# EAGLE design MJ828 - prod (EAGLE 9.4.0)
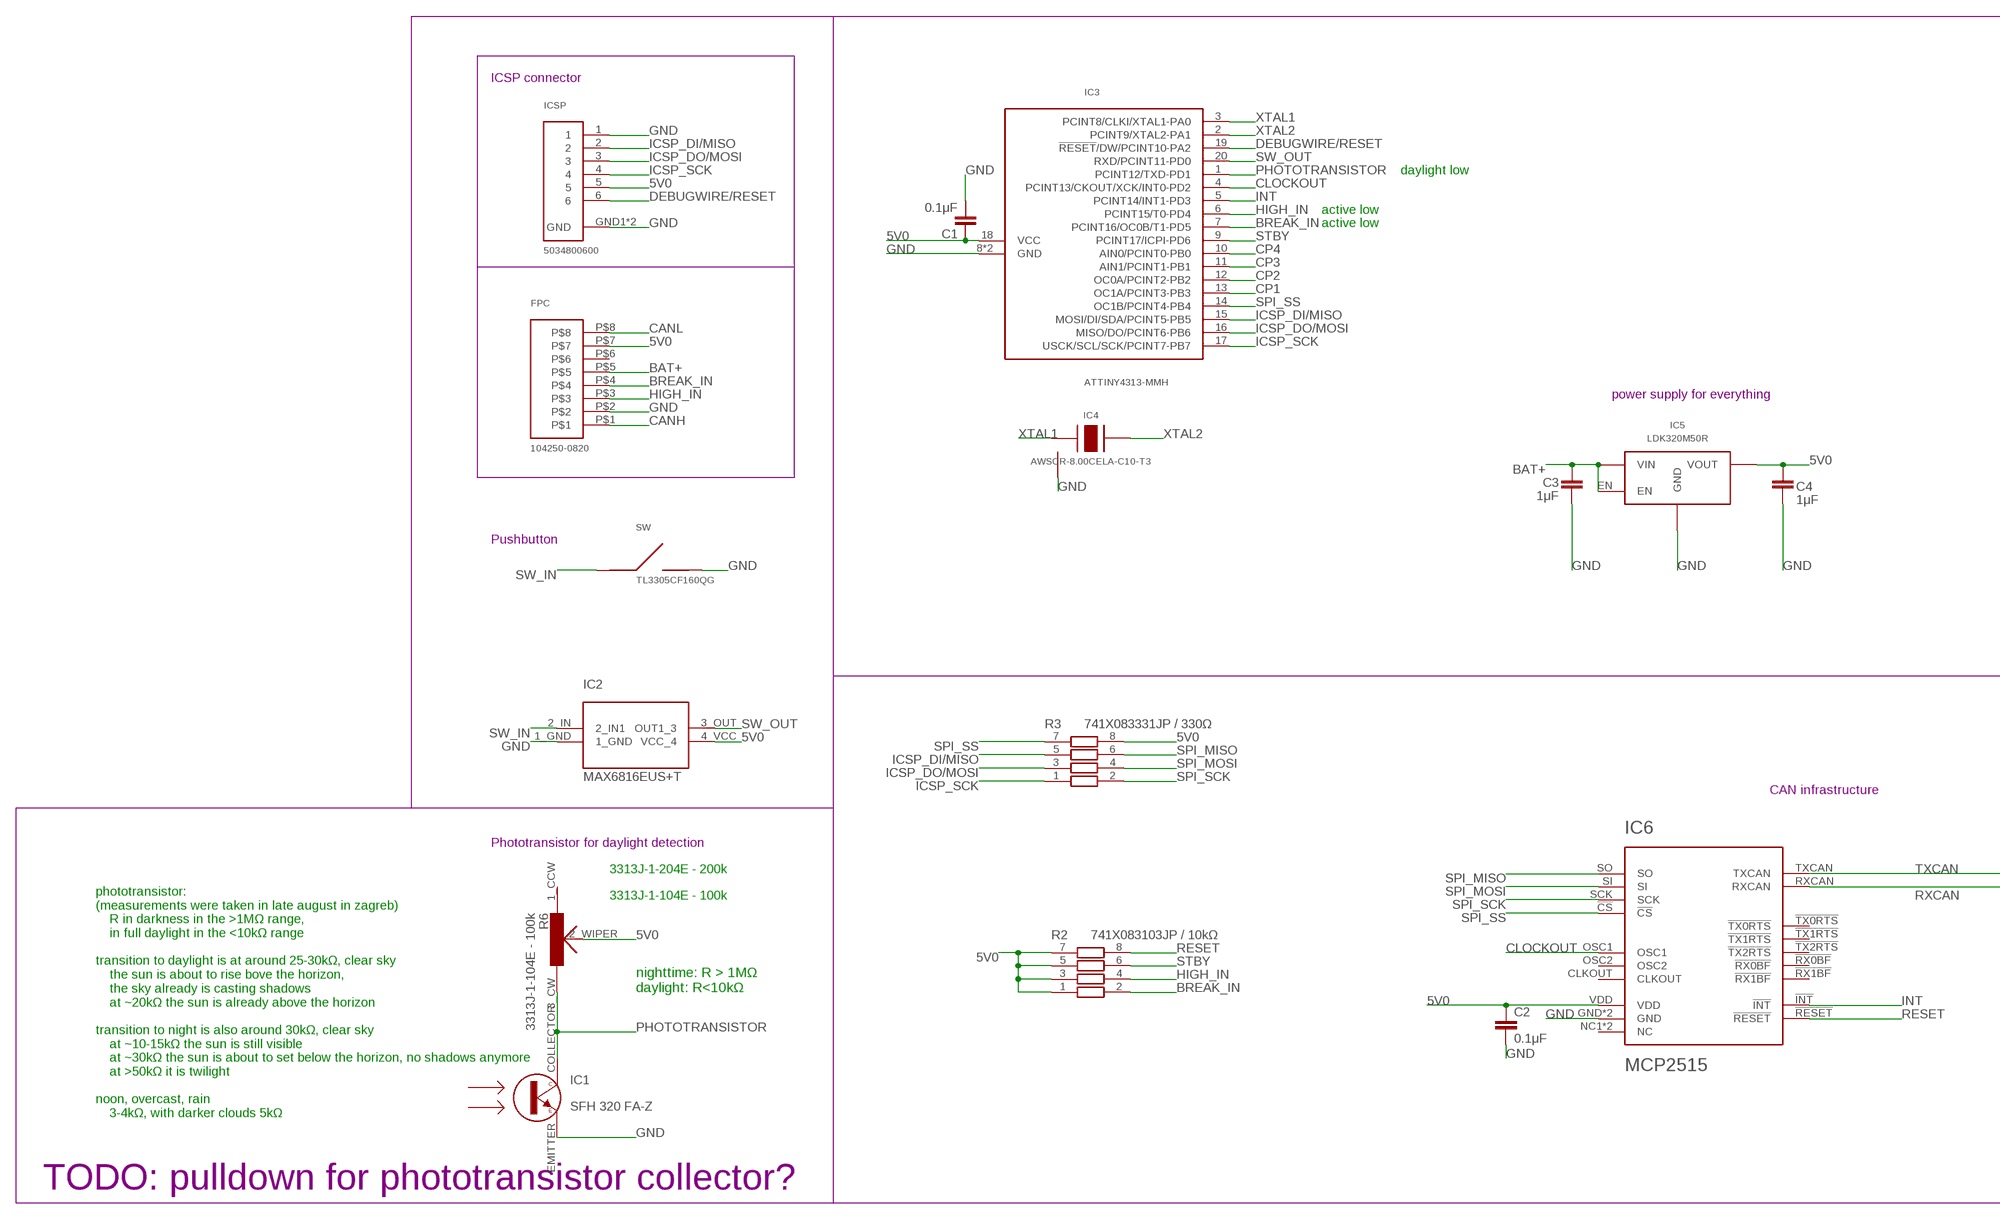
[diagram p0: schematic, sheet 1, part 1 of 2]
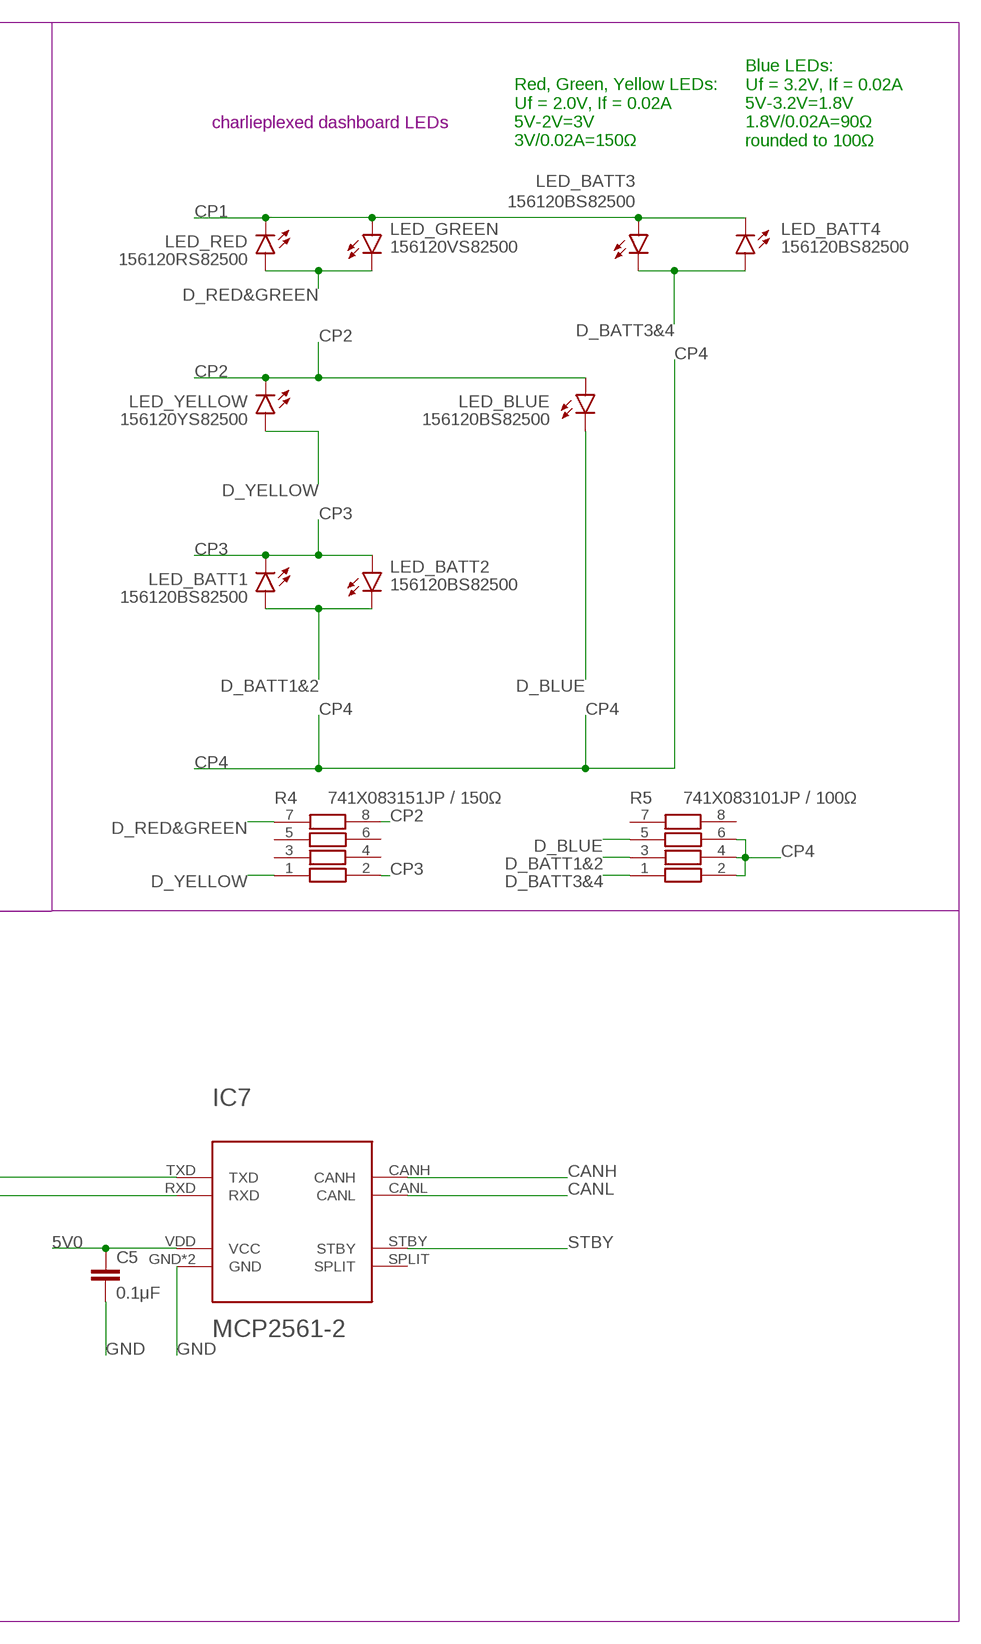
[diagram p1: schematic, sheet 1, part 2 of 2]

## Parts
C1  0.1μF  C-EUC0402  [C0402]
C2  0.1μF  C-EUC0402  [C0402]
C3  1μF  C-EUC0402  [C0402]
C4  1μF  C-EUC0402  [C0402]
C5  0.1μF  C-EUC0402  [C0402]
FPC  104250-0820  [SMD]
IC1  SFH 320 FA-Z  SFH320FA  [P-LCC-2]
IC2  MAX6816EUS+T  MAX6816  [4SOT143]
IC3  ATTINY4313-MMH  ATTINY4313VQFN-20  [VQFN-20]
IC4  AWSCR-8.00CELA-C10-T3  PRQV  [SMT]
IC5  LDK320M50R  LDK320SOT-23-5L  [SOT-23-5L]
IC6  MCP2515  MCP2515-I-ML  [QFN20]
IC7  MCP2561-2  [DFN10]
ICSP  5034800600  [SMT]
LED_BATT1  156120BS82500  LEDSML1206  [SML1206]
LED_BATT2  156120BS82500  LEDSML1206  [SML1206]
LED_BATT3  156120BS82500  LEDSML1206  [SML1206]
LED_BATT4  156120BS82500  LEDSML1206  [SML1206]
LED_BLUE  156120BS82500  LEDSML1206  [SML1206]
LED_GREEN  156120VS82500  LEDSML1206  [SML1206]
LED_RED  156120RS82500  LEDSML1206  [SML1206]
LED_YELLOW  156120YS82500  LEDSML1206  [SML1206]
R2  741X083103JP / 10kΩ  741X083331JP  [0402]
R3  741X083331JP / 330Ω  741X083331JP  [0402]
R4  741X083151JP / 150Ω  741X083331JP  [0402]
R5  741X083101JP / 100Ω  741X083331JP  [0402]
R6  3313J-1-104E - 100k  3313  [3313]
SW  TL3305CF160QG  TL3305-844809  [SMD]

## Nets
5V0 [5v0]: C1.1 C2.1 C4.2 C5.1 FPC.P$7 IC2.4_VCC(VCC_4) IC3.18(VCC) IC5.OUT(VOUT) IC6.VDD IC7.VDD(VCC) ICSP.5 R2.1 R2.3 R2.5 R2.7 R3.8 R6.2_WIPER
BAT+ [Bat+]: C3.1 FPC.P$5 IC5.EN IC5.IN(VIN)
BREAK_IN [signal]: FPC.P$4 IC3.7(PCINT16/OC0B/T1-PD5) R2.2
CANH [signal]: FPC.P$1 IC7.CANH
CANL [signal]: FPC.P$8 IC7.CANL
CLOCKOUT [signal]: IC3.4(PCINT13/CKOUT/XCK/INT0-PD2) IC6.OSC1
CP1 [signal]: IC3.13(OC1A/PCINT3-PB3) LED_BATT3.A LED_BATT4.C LED_GREEN.A LED_RED.C
CP2 [signal]: IC3.12(OC0A/PCINT2-PB2) LED_BLUE.A LED_YELLOW.C R4.8
CP3 [signal]: IC3.11(AIN1/PCINT1-PB1) LED_BATT1.C LED_BATT2.A R4.2
CP4 [signal]: IC3.10(AIN0/PCINT0-PB0) R5.2 R5.4 R5.6
D_BATT1&2 [signal]: LED_BATT1.A LED_BATT2.C R5.3
D_BATT3&4 [signal]: LED_BATT3.C LED_BATT4.A R5.1
D_BLUE [5v0]: LED_BLUE.C R5.5
D_RED&GREEN [signal]: LED_GREEN.C LED_RED.A R4.7
D_YELLOW [signal]: LED_YELLOW.A R4.1
DEBUGWIRE/RESET [signal]: IC3.19(!RESET!/DW/PCINT10-PA2) ICSP.6
GND: C1.2 C2.2 C3.2 C4.1 C5.2 FPC.P$2 IC1.EMITTER IC2.1_GND IC3.8(GND) IC3.GND IC4.GND IC5.GND IC6.GND IC6.GND6(GND) IC7.GND IC7.VSS(GND) ICSP.1 ICSP.GND1(GND) ICSP.GND2(GND) SW.3 SW.4
HIGH_IN [signal]: FPC.P$3 IC3.6(PCINT15/T0-PD4) R2.4
ICSP_DI/MISO [signal]: IC3.15(MOSI/DI/SDA/PCINT5-PB5) ICSP.2 R3.5
ICSP_DO/MOSI [signal]: IC3.16(MISO/DO/PCINT6-PB6) ICSP.3 R3.3
ICSP_SCK [signal]: IC3.17(USCK/SCL/SCK/PCINT7-PB7) ICSP.4 R3.1
INT [signal]: IC3.5(PCINT14/INT1-PD3) IC6.!INT!
PHOTOTRANSISTOR [signal]: IC1.COLLECTOR IC3.1(PCINT12/TXD-PD1) R6.3_CW
RESET [signal]: IC6.!RESET! R2.8
RXCAN [signal]: IC6.RXCAN IC7.RXD
SPI_MISO [signal]: IC6.SO R3.6
SPI_MOSI [signal]: IC6.SI R3.4
SPI_SCK [signal]: IC6.SCK R3.2
SPI_SS [signal]: IC3.14(OC1B/PCINT4-PB4) IC6.!CS! R3.7
STBY [signal]: IC3.9(PCINT17/ICPI-PD6) IC7.STBY R2.6
SW_IN [signal]: IC2.2_IN(2_IN1) SW.1 SW.2
SW_OUT [signal]: IC2.3_OUT(OUT1_3) IC3.20(RXD/PCINT11-PD0)
TXCAN [signal]: IC6.TXCAN IC7.TXD
XTAL1 [signal]: IC3.3(PCINT8/CLKI/XTAL1-PA0) IC4.XTAL1
XTAL2 [signal]: IC3.2(PCINT9/XTAL2-PA1) IC4.XTAL2
Unconnected: FPC.P$6 IC6.!RX0BF! IC6.!RX1BF! IC6.!TX0RTS! IC6.!TX1RTS! IC6.!TX2RTS! IC6.CLKOUT IC6.NC1(NC) IC6.NC2(NC) IC6.OSC2 IC7.SPLIT R4.3 R4.4 R4.5 R4.6 R5.7 R5.8 R6.1_CCW

## Notes on the sheet
- ICSP connector
- charlieplexed dashboard LEDs
- Red, Green, Yellow LEDs:
  Uf = 2.0V, If = 0.02A
  5V-2V=3V
  3V/0.02A=150Ω
- Blue LEDs:
  Uf = 3.2V, If = 0.02A
  5V-3.2V=1.8V
  1.8V/0.02A=90Ω
  rounded to 100Ω
- daylight low
- active low
- active low
- power supply for everything
- Pushbutton
- CAN infrastructure
- Phototransistor for daylight detection
- 3313J-1-204E - 200k
- phototransistor: 
  (measurements were taken in late august in zagreb)
      R in darkness in the >1MΩ range, 
      in full daylight in the <10kΩ range 
  
  transition to daylight is at around 25-30kΩ, clear sky
      the sun is about to rise bove the horizon,
      the sky already is casting shadows
      at ~20kΩ the sun is already above the horizon
  
  transition to night is also around 30kΩ, clear sky
      at ~10-15kΩ the sun is still visible
      at ~30kΩ the sun is about to set below the horizon, no shadows anymore
      at >50kΩ it is twilight
  
  noon, overcast, rain
      3-4kΩ, with darker clouds 5kΩ
- 3313J-1-104E - 100k
- nighttime: R > 1MΩ
  daylight: R<10kΩ
- TODO: pulldown for phototransistor collector?

## Library data of the parts
C1-C5 = rcl:C-EU: CAPACITOR, European symbol; SPICEPREFIX: C
FPC = 1042500820 - Board to Board Connector, 8p - Header:104250-0820
IC1 = SFH 320 FA - IR Phototransistor:SFH320FA
IC2 = MAX6818 CMOS Switch debouncer:MAX6816
IC3 = ATtiny4313 microcontroller:ATTINY4313; SPICEPREFIX: X
IC4 = PRQV8.00CR1510Y00L - 8MHz resonator:PRQV
IC5 = LDK320 5V LDO:LDK320
IC6 = MCP2515-I-ML - Standalonce CAN Controller with SPI Interface:MCP2515-I-ML
IC7 = MCP2561-2 - High-Speed CAN Transceiver:MCP2561-2
ICSP = 5034800600 FPC Connector:5034800600
LED_BATT1-LED_BATT4 LED_BLUE LED_GREEN LED_RED LED_YELLOW = led:LED: LED OSRAM: - CHIPLED LG R971, LG N971, LY N971, LG Q971, LY Q971, LO R971, LY R971 LH N974, LH R974 LS Q976, LO Q976, LY Q976 LO Q996 - Hyper CHIPLED LW Q18S LB Q993, LB Q99A, LB R99A - SideLED LS A670, LO A670, LY A670, LG A670, LP A670 LB A673, LV A673, LT A673, LW A673 LH A674 LY A675 LS A676, LA A676, LO A676, LY A676, LW A676 LS A679, LY A679, LG A679 - Hyper Micro SIDELED® LS Y876, LA Y876, LO Y876, LY Y876 LT Y87S - SmartLED LW L88C, LW L88S LB L89C, LB L89S, LG L890 LS L89K, LO L89K, LY L89K LS L896, LA L896, LO L896, LY L896 - TOPLED LS T670, LO T670, LY T670, LG T670, LP T670 LSG T670, LSP T670, LSY T670, LOP T670, LYG T670 LG T671, LOG T671, LSG T671 LB T673, LV T673, LT T673, LW T673 LH T674 LS T676, LA T676, LO T676, LY T676, LB T676, LH T676, LSB T676, LW T676 LB T67C, LV T67C, LT T67C, LS T67K, LO T67K, LY T67K, LW E67C LS E67B, LA E67B, LO E67B, LY E67B, LB E67C, LV E67C, LT E67C LW T67C LS T679, LY T679, LG T679 LS T770, LO T770, LY T770, LG T770, LP T770 LB T773, LV T773, LT T773, LW T773 LH T774 LS E675, LA E675, LY E675, LS T675 LS T776, LA T776, LO T776, LY T776, LB T776 LHGB T686 LT T68C, LB T68C - Hyper Mini TOPLED® LB M676 - Mini TOPLED Santana® LG M470 LS M47K, LO M47K, LY M47K Source: http://www.osram.convergy.de LUXEON: - LUMILED® LXK2-PW12-R00, LXK2-PW12-S00, LXK2-PW14-U00, LXK2-PW14-V00 LXK2-PM12-R00, LXK2-PM12-S00, LXK2-PM14-U00 LXK2-PE12-Q00, LXK2-PE12-R00, LXK2-PE12-S00, LXK2-PE14-T00, LXK2-PE14-U00 LXK2-PB12-K00, LXK2-PB12-L00, LXK2-PB12-M00, LXK2-PB14-N00, LXK2-PB14-P00, LXK2-PB14-Q00 LXK2-PR12-L00, LXK2-PR12-M00, LXK2-PR14-Q00, LXK2-PR14-R00 LXK2-PD12-Q00, LXK2-PD12-R00, LXK2-PD12-S00 LXK2-PH12-R00, LXK2-PH12-S00 LXK2-PL12-P00, LXK2-PL12-Q00, LXK2-PL12-R00 Source: www.luxeon.com KINGBRIGHT: KA-3528ASYC Source: www.kingbright.com
R2-R5 = 741X083331JP Resistor Array:741X083331JP
R6 = 3313 - Trim Poti:3313
SW = TL3305-844809 SPST-NO Tact Switch:TL3305-844809

## Net classes
0 GND: width 0.5 mm, drill 0.35 mm, clearance 0.2 mm
1 Bat+: width 0.5 mm, drill 0.35 mm, clearance 0.2 mm
2 5v0: width 0.3 mm, drill 0.35 mm, clearance 0.2 mm
3 signal: width 0.25 mm, drill 0.254 mm, clearance 0.2 mm

## Board
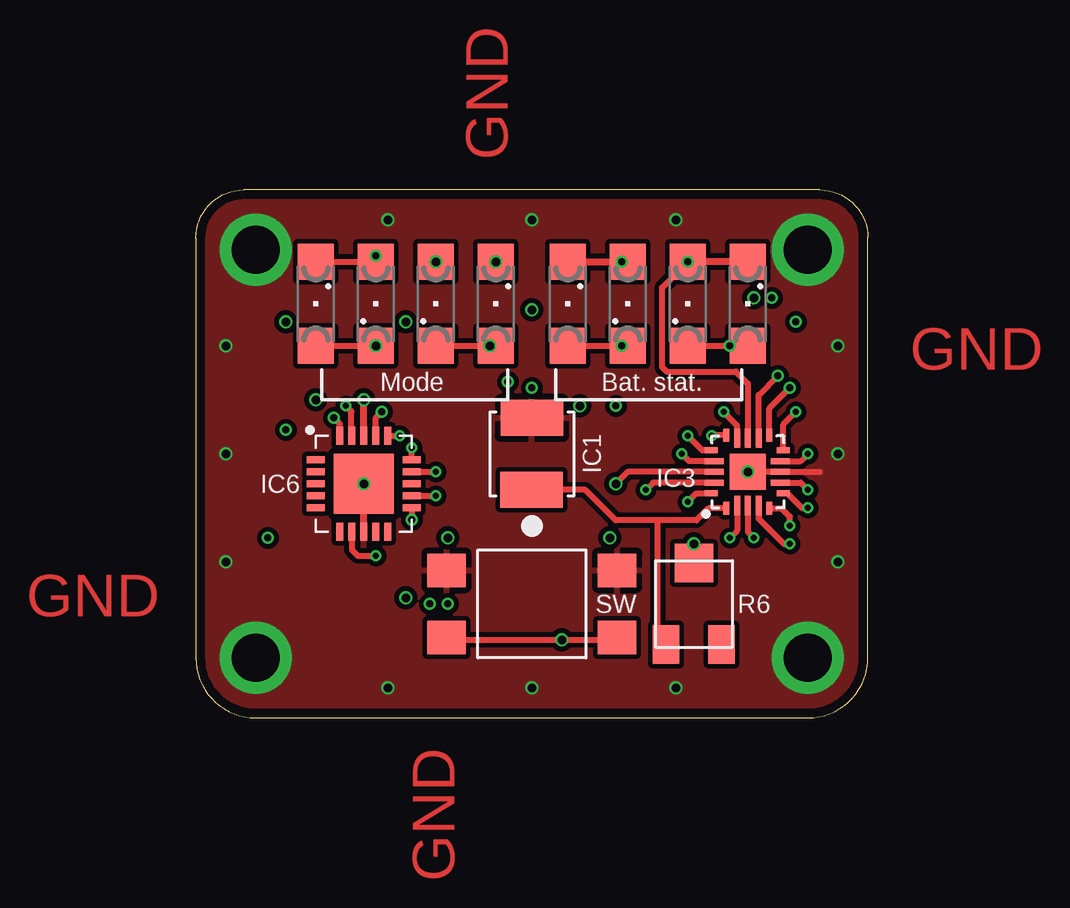
[diagram p2: board, top side]
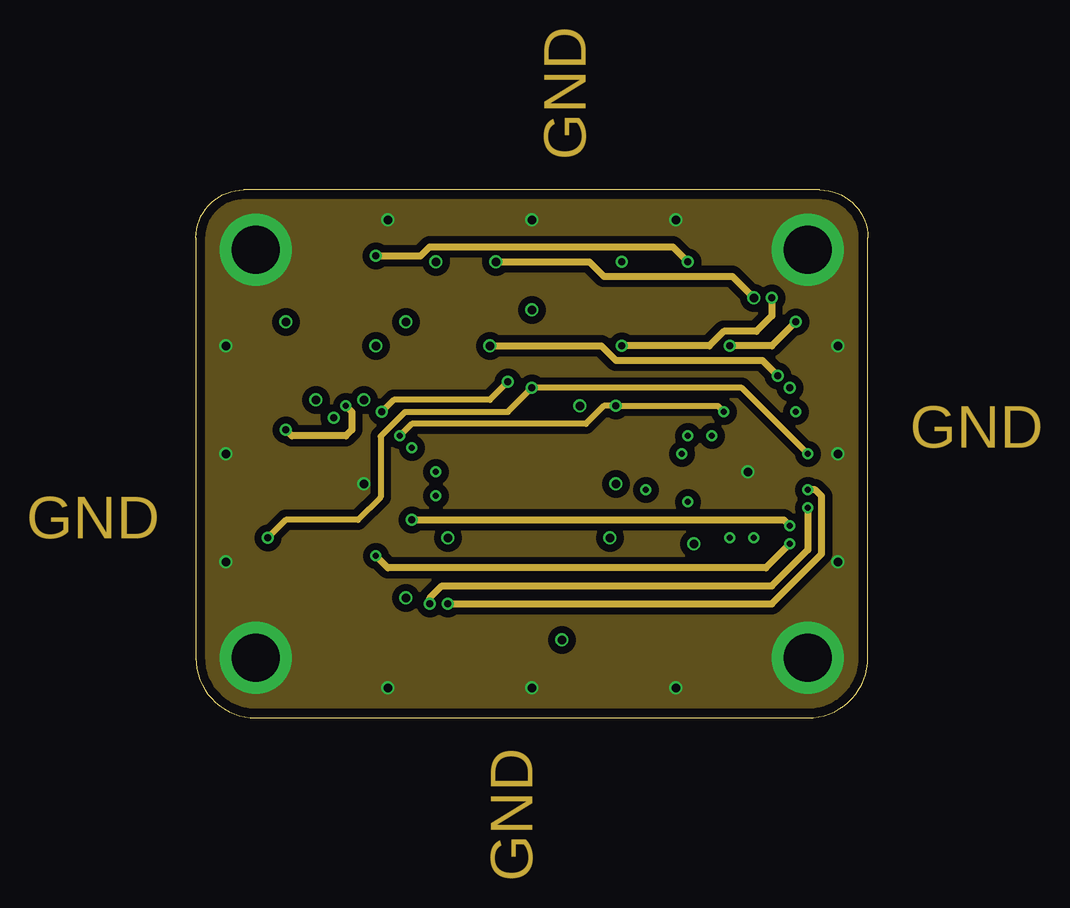
[diagram p3: board, inner layer Route2]
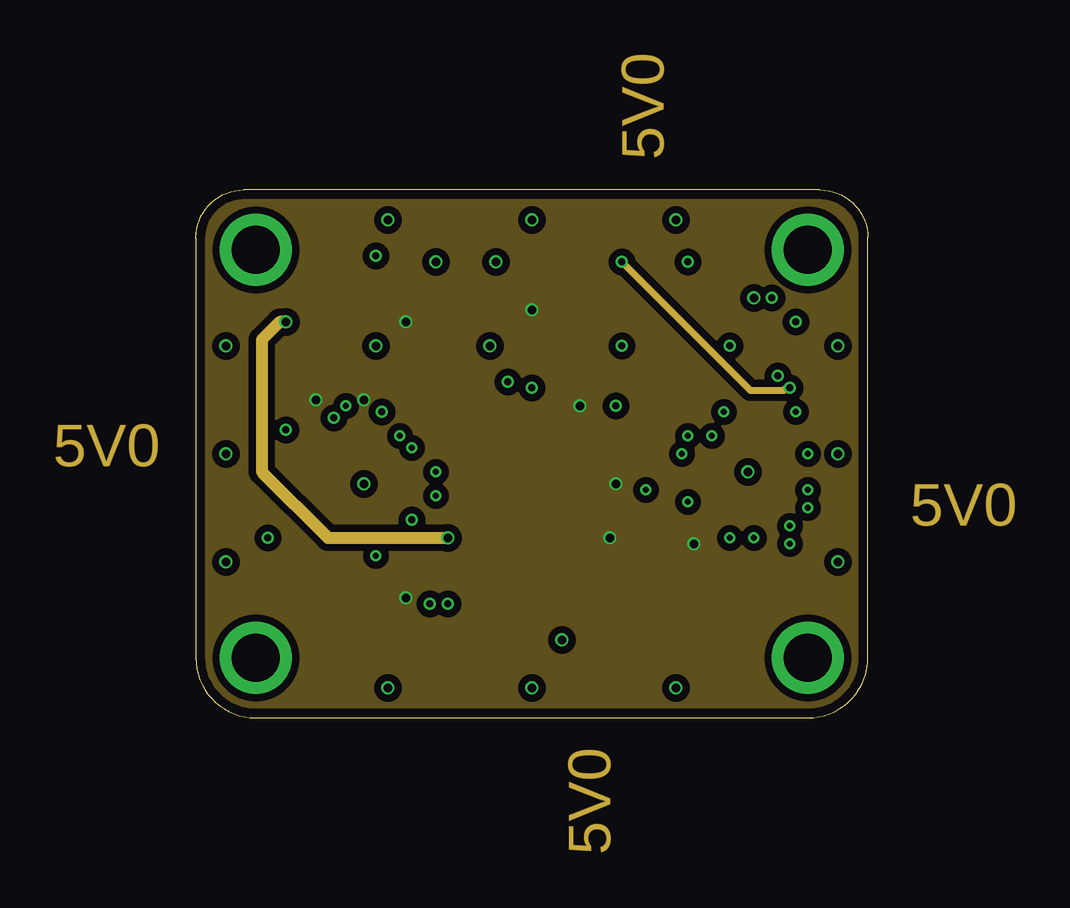
[diagram p4: board, inner layer Route15]
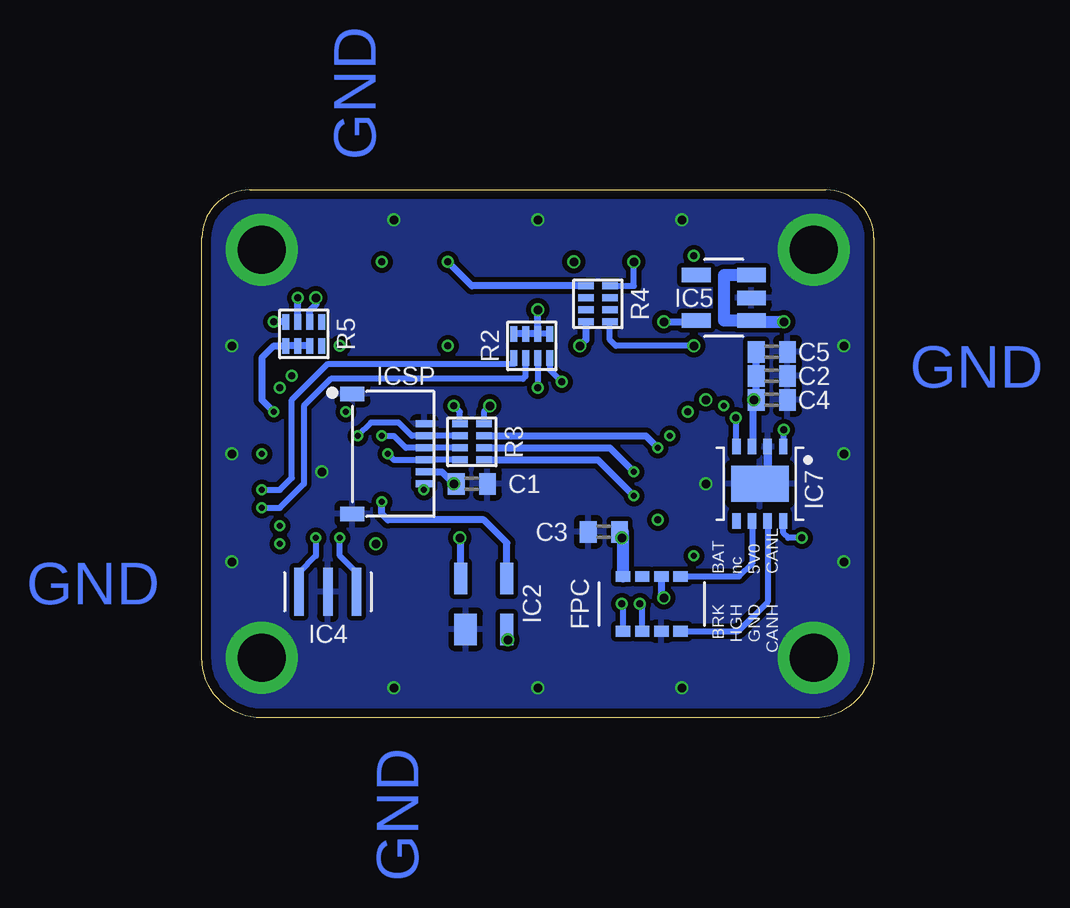
[diagram p5: board, bottom side, seen from below]

Size 28 x 22 mm. Coordinates in mm from the lower left corner, seen from the top.
Outline: 26,22 arc-90 28,20
Outline: 25.5,0 arc90 28,2.5
Outline: 0,2.5 arc90 2.5,0
Outline: 26,22 arc-90 28,20
Outline: 25.5,0 arc90 28,2.5
Outline: 0,2.5 arc90 2.5,0
Outline: 0,2.5 0,20 arc-90 2,22 26,22
Outline: 2.5,0 25.5,0
Outline: 28,2.5 28,20
Copper layers (1*2*15*16): Top 0.035559375mm / dielectric 0.17018125mm / Route2 0.01778125mm / dielectric 47mil / Route15 0.01778125mm / dielectric 0.17018125mm / Bottom 0.035559375mm
Design rules "oshpark-4layer": minimum track width 5mil, minimum drill 10mil, track to track 5mil, track to pad 5mil, pad to pad 5mil, via to via 5mil, smd to smd 5mil, copper to edge 15mil, drill to drill 6mil, minimum pad ring 4mil, minimum via ring 4mil, stop-mask expansion 2.5mil, vias tented up to drill 0mil, thermal gap 10mil
tRestrict: 6 lines

### Footprints (pad centres in the part's own frame; a part is rotated, then mirrored left to right if it is on the bottom)
C0402 = smd 0.7 x 0.9: 1 -0.65,0; 2 0.65,0
SMD = smd 0.6 x 0.45: P$1 -1.2,1.14; P$2 -0.4,1.14; P$3 0.4,1.14; P$4 1.2,1.14; P$5 1.2,-1.14; P$6 0.4,-1.14; P$7 -0.4,-1.14; P$8 -1.2,-1.14
P-LCC-2 = smd 2.6 x 1.5: COLLECTOR -0.02,-1.5; EMITTER 0,1.5
4SOT143 = smd 0.94 x 1.31: 1_GND -0.76,-1.06 | smd 0.55 x 1.31: 2_IN 0.96,-1.06; 3_OUT 0.96,1.06; 4_VCC -0.96,1.06
VQFN-20 = smd 0.55 x 0.25: 1 -1.52,0.9; 5 -1.52,-0.9; 11 1.52,-0.9; 15 1.52,0.9 | smd 0.8 x 0.25: 2 -1.4,0.45; 3 -1.4,0; 4 -1.4,-0.45; 12 1.4,-0.45; 13 1.4,0; 14 1.4,0.45 | smd 0.25 x 0.55: 6 -0.9,-1.48; 10 0.9,-1.48; 16 0.9,1.52; 20 -0.9,1.52 | smd 0.25 x 0.8: 7 -0.45,-1.35; 8 0,-1.35; 9 0.45,-1.35; 17 0.45,1.4; 18 0,1.4; 19 -0.45,1.4 | smd 1.5 x 1.5: GND 0,0
SMT = smd 0.4 x 2: GND 0,0; XTAL1 -1.2,0; XTAL2 1.2,0
SOT-23-5L = smd 0.6 x 1.2: ADJ/NC -0.95,-1.15; EN -0.95,1.15; GND 0,1.15; IN 0.95,1.15; OUT 0.95,-1.15
QFN20 = smd 0.3 x 0.75: !CS! 1,2; !RESET! 0.5,2; !RX0BF! 1,-2; !RX1BF! 0.5,-2; GND6 0,-2; OSC1 -0.5,-2; OSC2 -1,-2; RXCAN -1,2; TXCAN -0.5,2; VDD 0,2 | smd 0.75 x 0.3: !INT! 2,-1; !TX0RTS! -2,0.5; !TX1RTS! -2,0; !TX2RTS! -2,-1; CLKOUT -2,1; NC1 -2,-0.5; NC2 2,0; SCK 2,-0.5; SI 2,0.5; SO 2,1 | smd 2.5 x 2.5: GND 0,0
DFN10 = smd 0.35 x 0.65: CANH -0.325,1.55; CANL 0.325,1.55; RXD 0.975,-1.55; SPLIT 0.975,1.55; STBY -0.975,1.55; TXD -0.975,-1.55; VDD 0.325,-1.55; VSS -0.325,-1.55 | smd 2.4 x 1.5: GND 0,0
SMT' = smd 0.3 x 0.7: 1 -1.25,1.27; 2 -0.75,1.27; 3 -0.25,1.27; 4 0.25,1.27; 5 0.75,1.27; 6 1.25,1.27 | smd 0.6 x 1: GND1 -2.5,-1.73; GND2 2.5,-1.73
SML1206 = smd 1.5 x 1.5: A 1.75,0; C -1.75,0
0402 = smd 0.65 x 0.3: 1 -0.5,-0.75; 2 0.5,-0.75; 3 -0.5,-0.25; 4 0.5,-0.25; 5 -0.5,0.25; 6 0.5,0.25; 7 -0.5,0.75; 8 0.5,0.75
3313 = smd 1.1 x 1.6: 1_CCW 1.155,-1.7; 3_CW -1.155,-1.7 | smd 1.6 x 1.6: 2_WIPER 0,1.7
SMD' = smd 1.6 x 1.4: 1 -3.556,-1.397; 2 3.556,-1.397; 3 -3.556,1.397; 4 3.556,1.397

### Placement (x,y rotation side)
C1  16.75,9.75 0 bottom
C2  4.25,14.25 0 bottom
C3  11.25,7.75 180 bottom
C4  4.25,13.25 180 bottom
C5  4.25,15.25 0 bottom
FPC  9.25,4.75 180 bottom
IC1  14,11 0 top
IC2  16.25,4.75 0 bottom
IC3  23,10.25 90 top
IC4  22.75,5.25 0 bottom
IC5  6.25,17.5 270 bottom
IC6  7,9.75 0 top
IC7  4.75,9.75 180 bottom
ICSP  5034800600  [SMT']  20,11 270 bottom
LED_BATT1  15.5,17.25 270 top
LED_BATT2  18,17.25 90 top
LED_BATT3  20.5,17.25 90 top
LED_BATT4  23,17.25 270 top
LED_BLUE  12.5,17.25 270 top
LED_GREEN  7.5,17.25 90 top
LED_RED  5,17.25 270 top
LED_YELLOW  10,17.25 90 top
R2  14.25,15.5 270 bottom
R3  16.75,11.5 0 bottom
R4  11.5,17.25 180 bottom
R5  23.75,16 270 bottom
R6  20.75,4.75 0 top
SW  TL3305CF160QG  [SMD']  14,4.75 0 top

### Tracks (layer width: path | path; a pad name or v marks a point on that pad's centre or on a via)
5V0  (via drill 0.35)
  Top 0.25: IC3.18 18,10.25 v17.5,9.75
  Top 0.3: IC6.VDD v7,13.25 | R6.2_WIPER v20.75,7.25
  Bottom 0.25: v16,13 16.25,12.75 R3.8 | R2.7 R2.5
  Bottom 0.3: v17.25,7.5 17.21,7.46 IC2.4_VCC | v14,17 R2.5 R2.3 R2.1 | ICSP.5 18,10.25 v17.5,9.75 | FPC.P$7 8.85,5.1 v8.75,5 | C5.1 C2.1 C4.2 v5,13.25 5.05,13.2 5.05,11.32 IC7.VDD | v8.75,16.5 7.45,16.5 IC5.OUT
  Bottom 0.5: C1.1 v17.5,9.75
  pour Route15 (isolate 0.3): 0,22 0,0 28,0 28,22
BAT+  (via drill 0.35)
  Route15 0.5: v3.75,16.5 3.5,16.5 2.75,15.75 2.75,10.26 5.51,7.5 v10.5,7.5
  Bottom 0.5: IC5.EN 6.25,18.45 6.25,16.55 IC5.IN 5.05,16.5 v3.75,16.5 | FPC.P$5 10.45,7.45 | 10.45,7.45 10.45,7.75 C3.1 | 10.45,7.45 v10.5,7.5
BREAK_IN  (via drill 0.25, 0.3)
  Top 0.25: IC3.7 25.2,9.8 v25.5,9.5
  Route2 0.3: v10.5,4.75 24,4.75 26.08,6.83 26.08,9.24 25.82,9.5 v25.5,9.5
  Bottom 0.25: FPC.P$4 10.45,4.7 v10.5,4.75 | v25.5,9.5 24.75,9.5 24.25,10 24.25,13.25 22.75,14.75 15,14.75 R2.2
CANH
  Bottom 0.25: IC7.CANH 4.42,4.83 5.64,3.61 FPC.P$1
CANL
  Bottom 0.25: IC7.CANL 5.08,6.42 5.61,5.89 FPC.P$8
CLOCKOUT  (via drill 0.25)
  Top 0.25: v24.75,7.25 24.5,7.25 23.45,8.3 IC3.4 | IC6.OSC1 6.5,7 6.75,6.75 v7.5,6.75
  Route2 0.3: v7.5,6.75 8,6.25 23.75,6.25 v24.75,7.25
CP1  (via drill 0.3)
  Top 0.25: LED_RED.C LED_GREEN.A v7.5,19.25 | LED_BATT4.C 23.12,18.88 | LED_BATT3.A 19.43,17.93 19.43,14.62 19.61,14.43 22.5,14.43 23,13.93 IC3.13
  Top 0.3: LED_BATT4.C LED_BATT3.A
  Route2 0.3: v7.5,19.25 9.36,19.25 9.74,19.63 19.87,19.63 LED_BATT3.A
  other vias: 20.5,19
CP2  (via drill 0.3, 0.35)
  Top 0.25: LED_BLUE.A v12.25,15.5 LED_YELLOW.C | IC3.12 23.45,13.45 v24.25,14.25
  Route2 0.3: v12.25,15.5 16.9,15.5 17.5,14.9 23.6,14.9 v24.25,14.25
  Bottom 0.3: R4.8 12,15.75 v12.25,15.5
CP3  (via drill 0.3)
  Top 0.25: IC3.11 23.9,12.9 v24.75,13.75
  Top 0.3: LED_BATT1.C v17.75,19 LED_BATT2.A
  Route15 0.3: v24.75,13.75 24.6,13.75 24.5,13.65 23.1,13.65 v17.75,19
  Bottom 0.3: R4.2 16.75,18 v17.75,19
CP4  (via drill 0.25)
  Top 0.25: IC3.10 24.48,12.23 v25,12.75
  Bottom 0.3: v25,12.75 25.5,13.25 25.5,15 25,15.5 R5.2 R5.4 R5.6
D_BATT1&2  (via drill 0.3)
  Top 0.25: LED_BATT1.A v17.75,15.5
  Top 0.3: LED_BATT2.C v17.75,15.5
  Route2 0.3: v17.75,15.5 21.4,15.5 22,16.1 23.35,16.1 24,16.75 v24,17.5
  Bottom 0.3: R5.3 v24,17.5
D_BATT3&4  (via drill 0.3)
  Top 0.25: LED_BATT3.C LED_BATT4.A v22.25,15.5
  Route2 0.3: v25,16.5 24,15.5 v22.25,15.5
  Bottom 0.3: R5.1 v25,16.5
D_BLUE  (via drill 0.35)
  Route2 0.3: v23.25,17.5 22.35,18.4 17,18.4 16.4,19 LED_BLUE.C
  Bottom 0.3: R5.5 23.5,16.97 23.25,17.22 v23.25,17.5
  other vias: 12.5,19
D_RED&GREEN  (via drill 0.35)
  Top 0.25: LED_RED.A LED_GREEN.C
  Bottom 0.25: LED_GREEN.C 10.75,15.5 11,15.75 R4.7
  other vias: 7.5,15.5
D_YELLOW  (via drill 0.35)
  Bottom 0.25: R4.1 10,18 LED_YELLOW.A
  other vias: 10,19
DEBUGWIRE/RESET  (via drill 0.25)
  Top 0.25: IC3.19 19.05,9.8 v18.75,9.5
  Bottom 0.3: v18.75,9.5 18.75,9.75 ICSP.6
GND  (via drill 0.35, 2)
  Top 0.25: IC3.GND IC3.8 26,10.25
  Top 0.3: IC6.GND6 IC6.GND
  Bottom 0.35: IC7.VSS 4.42,10.07
  Bottom 0.5: 4.42,10.07 IC7.GND
  other vias: 2.5,19.5 2.5,2.5 25.5,2.5 25.5,19.5 14,20.75 26.75,11 14,1.25 1.25,11 1.25,6.5 1.25,15.5 26.75,15.5 26.75,6.5 20,20.75 20,1.25 8,20.75 8,1.25 7,9.75 23,10.25
  pour Top: 0,22 28,22 28,0 0,0
  pour Bottom: 0,22 28,22 28,0 0,0
  pour Route2 (isolate 0.3): 0,22 28,22 28,0 0,0
HIGH_IN  (via drill 0.25, 0.3)
  Top 0.25: IC3.6 24.65,9.35 25.25,8.75 v25.5,8.75
  Route2 0.3: v9.75,4.75 9.75,5 10.25,5.5 24,5.5 25.5,7 v25.5,8.75
  Bottom 0.25: FPC.P$3 9.65,4.65 v9.75,4.75 | v25.5,8.75 24.75,8.75 23.75,9.75 23.75,13 22.62,14.12 14.62,14.12 14.53,14.22 14.53,14.97 R2.4
ICSP_DI/MISO  (via drill 0.25)
  Top 0.25: IC3.15 21.52,11.77 v21.5,11.75
  Bottom 0.25: R3.5 ICSP.2 19.25,11.75 19.8,12.3 20.95,12.3 v21.5,11.75
ICSP_DO/MOSI  (via drill 0.25)
  Top 0.25: IC3.16 21.1,11.15 v20.5,11.75
  Bottom 0.25: R3.3 ICSP.3 19.5,11.25 20,11.75 v20.5,11.75
ICSP_SCK  (via drill 0.25)
  Top 0.25: IC3.17 20.55,10.7 v20.25,11
  Bottom 0.25: R3.1 ICSP.4 20,10.75 v20.25,11
INT  (via drill 0.25, 0.3)
  Top 0.25: IC6.!INT! v9,8.25 | v24.75,8 24.75,8.38 24.4,8.73 IC3.5
  Route2 0.3: v9,8.25 24.5,8.25 v24.75,8
PHOTOTRANSISTOR
  Top 0.25: IC3.1 21.35,8.73 20.85,8.23 19.25,8.23 | 19.25,8.23 17.5,8.23 16.23,9.5 IC1.COLLECTOR | R6.3_CW 19.25,3.4 19.25,8.23
RESET  (via drill 0.3)
  Top 0.25: IC6.!RESET! 7.5,12.5 v7.75,12.75
  Route2 0.25: v7.75,12.75 8.25,13.25 12.25,13.25 v13,14
  Bottom 0.25: v13,14 13.5,14.5 R2.8
RXCAN  (via drill 0.3)
  Top 0.25: IC6.RXCAN 6,12.25 v5.75,12.5
  Bottom 0.25: IC7.RXD 5.72,12.47 v5.75,12.5
SPI_MISO  (via drill 0.25)
  Top 0.25: IC6.SO v9,11.25
  Bottom 0.3: R3.6 9.5,11.75 v9,11.25
SPI_MOSI  (via drill 0.25)
  Top 0.25: IC6.SI v10,10.25
  Bottom 0.3: R3.4 11,11.25 v10,10.25
SPI_SCK  (via drill 0.25)
  Top 0.25: IC6.SCK v10,9.25
  Bottom 0.3: R3.2 11.5,10.75 v10,9.25
SPI_SS  (via drill 0.25, 0.3)
  Top 0.25: IC6.!CS! v8.5,11.75 | IC3.14 22.55,12.18 22,12.73 v22,12.75
  Route2 0.25: v8.5,11.75 9,12.25 16.25,12.25 17,13 v17.5,13 21.75,13 v22,12.75
  Bottom 0.25: R3.7 17.25,12.75 v17.5,13
STBY  (via drill 0.25, 0.3)
  Top 0.25: IC3.9 25.2,10.7 v25.5,11
  Route2 0.25: v25.5,11 22.75,13.75 v14,13.75 13,12.75 8.72,12.75 7.7,11.73 7.7,9.2 6.75,8.25 3.75,8.25 v3,7.5
  Bottom 0.25: v3,7.5 3.58,7.5 3.77,7.7 IC7.STBY | R2.6 v14,13.75
SW_IN  (via drill 0.35)
  Top 0.25: SW.2 17.45,3.25 v15.25,3.25 10.55,3.25 SW.1
  Bottom 0.25: IC2.2_IN 15.29,3.29 v15.25,3.25
SW_OUT  (via drill 0.25)
  Top 0.25: v20.5,9 20.85,9.35 IC3.20
  Bottom 0.3: IC2.3_OUT 15.29,7.29 16.25,8.25 20.25,8.25 20.5,8.5 v20.5,9
TXCAN  (via drill 0.25, 0.3)
  Top 0.25: IC6.TXCAN 6.47,11.78 6.47,12.78 v6.25,13
  Route2 0.3: v6.25,13 6.5,12.75 6.5,12 6.25,11.75 4,11.75 v3.75,12
  Bottom 0.25: IC7.TXD 3.75,11.32 v3.75,12
XTAL1  (via drill 0.25)
  Top 0.25: IC3.3 23,7.75 v23.25,7.5
  Bottom 0.25: IC4.XTAL1 23.95,6.05 23.25,6.75 v23.25,7.5
XTAL2  (via drill 0.25)
  Top 0.25: IC3.2 22.55,7.8 v22.25,7.5
  Bottom 0.25: IC4.XTAL2 21.55,6.05 22.25,6.75 v22.25,7.5

### Text on the board
Top: GND | GND | GND | GND
Route2: GND | GND | GND | GND
Route15: 5V0 | 5V0 | 5V0 | 5V0
Bottom: GND | GND | GND | GND
tPlace: Mode | Bat. stat.
bPlace: CANL | 5V0 | nc | BAT | CANH | GND | HGH | BRK
tStop: MJ-828 / ejovrh v.2